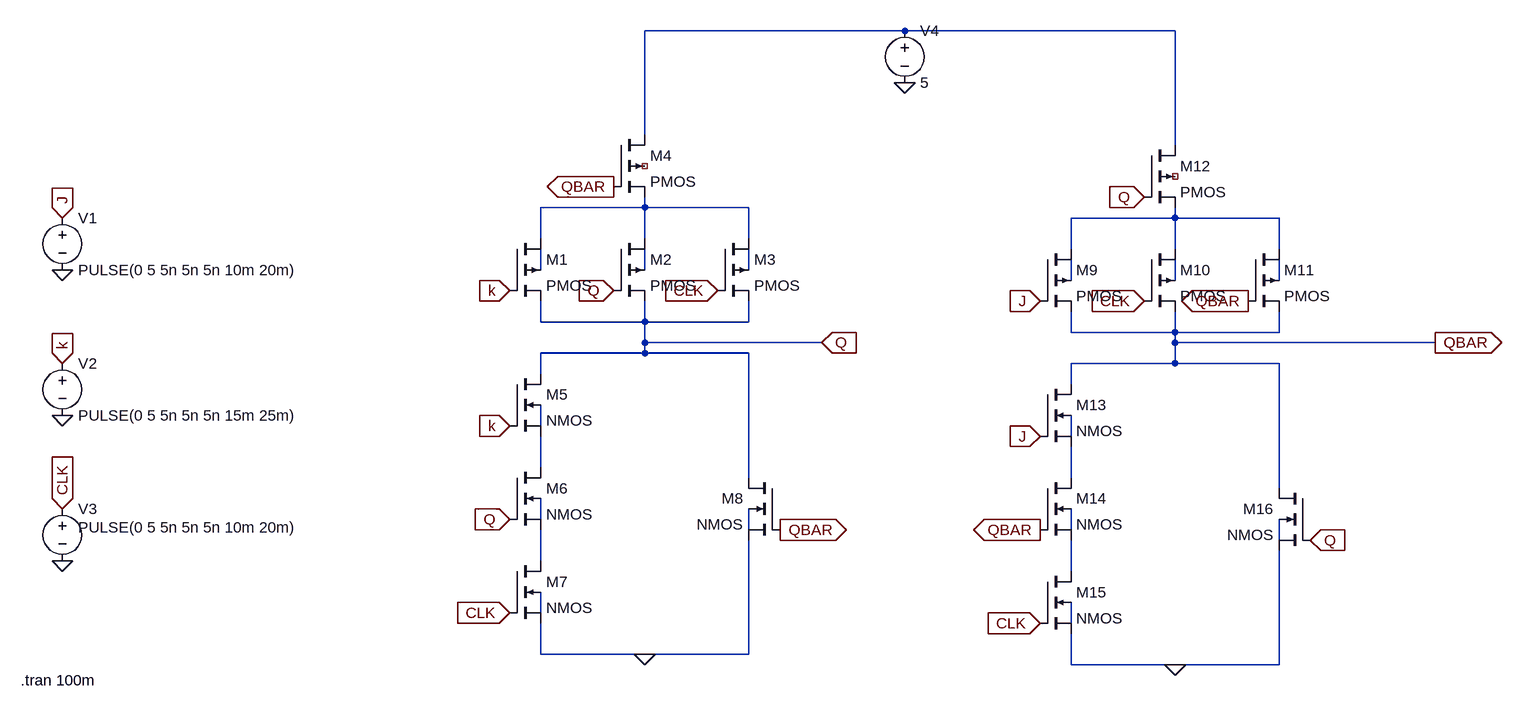
[diagram p0: schematic JK_FLIP.asc]
JK_FLIP.asc, the LTspice schematic file:
Version 4
SHEET 1 1580 744
WIRE 640 -272 240 -272
WIRE 1056 -272 640 -272
WIRE 240 -112 240 -272
WIRE 1056 -96 1056 -272
WIRE 240 0 240 -16
WIRE 240 0 80 0
WIRE 400 0 240 0
WIRE 1056 16 1056 0
WIRE 1056 16 896 16
WIRE 1216 16 1056 16
WIRE 80 48 80 0
WIRE 240 48 240 0
WIRE 400 48 400 0
WIRE 896 64 896 16
WIRE 1056 64 1056 16
WIRE 1216 64 1216 16
WIRE 80 96 80 64
WIRE 240 96 240 64
WIRE 400 96 400 64
WIRE 896 112 896 80
WIRE 1056 112 1056 80
WIRE 1216 112 1216 80
WIRE 80 176 80 144
WIRE 240 176 240 144
WIRE 240 176 80 176
WIRE 400 176 400 144
WIRE 400 176 240 176
WIRE 896 192 896 160
WIRE 1056 192 1056 160
WIRE 1056 192 896 192
WIRE 1216 192 1216 160
WIRE 1216 192 1056 192
WIRE 240 208 240 176
WIRE 512 208 240 208
WIRE 1056 208 1056 192
WIRE 1456 208 1056 208
WIRE 240 224 240 208
WIRE 240 224 80 224
WIRE 400 224 240 224
WIRE 1056 240 1056 208
WIRE 1056 240 896 240
WIRE 1216 240 1056 240
WIRE 80 256 80 224
WIRE 896 272 896 240
WIRE 80 336 80 304
WIRE 896 352 896 320
WIRE 80 400 80 352
WIRE 400 416 400 224
WIRE 896 416 896 368
WIRE 1216 432 1216 240
WIRE 80 480 80 448
WIRE 400 496 400 464
WIRE 896 496 896 464
WIRE 1216 512 1216 480
WIRE 80 544 80 496
WIRE 896 560 896 512
WIRE 80 624 80 592
WIRE 896 640 896 608
WIRE 80 688 80 640
WIRE 240 688 80 688
WIRE 400 688 400 512
WIRE 400 688 240 688
WIRE 896 704 896 656
WIRE 1056 704 896 704
WIRE 1216 704 1216 528
WIRE 1216 704 1056 704
FLAG 640 -192 0
FLAG -656 96 0
FLAG -656 320 0
FLAG -656 544 0
FLAG 240 688 0
FLAG 1056 704 0
FLAG -656 16 J
IOPIN -656 16 In
FLAG 848 352 J
IOPIN 848 352 In
FLAG 848 144 J
IOPIN 848 144 In
FLAG -656 240 k
IOPIN -656 240 In
FLAG 32 128 k
IOPIN 32 128 In
FLAG 32 336 k
IOPIN 32 336 In
FLAG -656 464 CLK
IOPIN -656 464 In
FLAG 32 624 CLK
IOPIN 32 624 In
FLAG 352 128 CLK
IOPIN 352 128 In
FLAG 1008 144 CLK
IOPIN 1008 144 In
FLAG 848 640 CLK
IOPIN 848 640 In
FLAG 512 208 Q
IOPIN 512 208 In
FLAG 192 128 Q
IOPIN 192 128 In
FLAG 32 480 Q
IOPIN 32 480 In
FLAG 1264 512 Q
IOPIN 1264 512 In
FLAG 1008 -16 Q
IOPIN 1008 -16 In
FLAG 1456 208 QBAR
IOPIN 1456 208 Out
FLAG 848 496 QBAR
IOPIN 848 496 Out
FLAG 1168 144 QBAR
IOPIN 1168 144 Out
FLAG 192 -32 QBAR
IOPIN 192 -32 Out
FLAG 448 496 QBAR
IOPIN 448 496 Out
SYMBOL pmos4 32 48 R0
SYMATTR InstName M1
SYMBOL pmos4 192 48 R0
SYMATTR InstName M2
SYMBOL pmos4 352 48 R0
SYMATTR InstName M3
SYMBOL pmos4 192 -112 R0
SYMATTR InstName M4
SYMBOL nmos4 32 256 R0
SYMATTR InstName M5
SYMBOL nmos4 32 400 R0
SYMATTR InstName M6
SYMBOL nmos4 32 544 R0
SYMATTR InstName M7
SYMBOL nmos4 448 416 M0
SYMATTR InstName M8
SYMBOL pmos4 848 64 R0
SYMATTR InstName M9
SYMBOL pmos4 1008 64 R0
SYMATTR InstName M10
SYMBOL pmos4 1168 64 R0
SYMATTR InstName M11
SYMBOL pmos4 1008 -96 R0
SYMATTR InstName M12
SYMBOL nmos4 848 272 R0
SYMATTR InstName M13
SYMBOL nmos4 848 416 R0
SYMATTR InstName M14
SYMBOL nmos4 848 560 R0
SYMATTR InstName M15
SYMBOL nmos4 1264 432 M0
SYMATTR InstName M16
SYMBOL voltage -656 0 R0
WINDOW 123 0 0 Left 0
WINDOW 39 0 0 Left 0
SYMATTR InstName V1
SYMATTR Value PULSE(0 5 5n 5n 5n 10m 20m)
SYMBOL voltage -656 224 R0
WINDOW 123 0 0 Left 0
WINDOW 39 0 0 Left 0
SYMATTR InstName V2
SYMATTR Value PULSE(0 5 5n 5n 5n 15m 25m)
SYMBOL voltage -656 448 R0
WINDOW 3 24 44 Left 2
WINDOW 123 0 0 Left 0
WINDOW 39 0 0 Left 0
SYMATTR Value PULSE(0 5 5n 5n 5n 10m 20m)
SYMATTR InstName V3
SYMBOL voltage 640 -288 R0
WINDOW 123 0 0 Left 0
WINDOW 39 0 0 Left 0
SYMATTR InstName V4
SYMATTR Value 5
TEXT -720 728 Left 2 !.tran 100m

The netlist it stands for:
* JK_FLIP.asc
M1 N002 k Q N004 PMOS
M2 N002 Q Q N005 PMOS
M3 N002 CLK Q N006 PMOS
M4 N001 QBAR N002 NC_01 PMOS
M5 Q k N012 N010 NMOS
M6 N012 Q N018 N014 NMOS
M7 N018 CLK 0 N020 NMOS
M8 Q QBAR 0 N015 NMOS
M9 N003 J QBAR N007 PMOS
M10 N003 CLK QBAR N008 PMOS
M11 N003 QBAR QBAR N009 PMOS
M12 N001 Q N003 NC_02 PMOS
M13 QBAR J N013 N011 NMOS
M14 N013 QBAR N019 N016 NMOS
M15 N019 CLK 0 N021 NMOS
M16 QBAR Q 0 N017 NMOS
V1 J 0 PULSE(0 5 5n 5n 5n 10m 20m)
V2 k 0 PULSE(0 5 5n 5n 5n 15m 25m)
V3 CLK 0 PULSE(0 5 5n 5n 5n 10m 20m)
V4 N001 0 5
.model NMOS NMOS
.model PMOS PMOS
.lib standard.mos
.tran 100m
.backanno
.end